# EAGLE design Conectores M2 v2 (EAGLE 9.6.2)
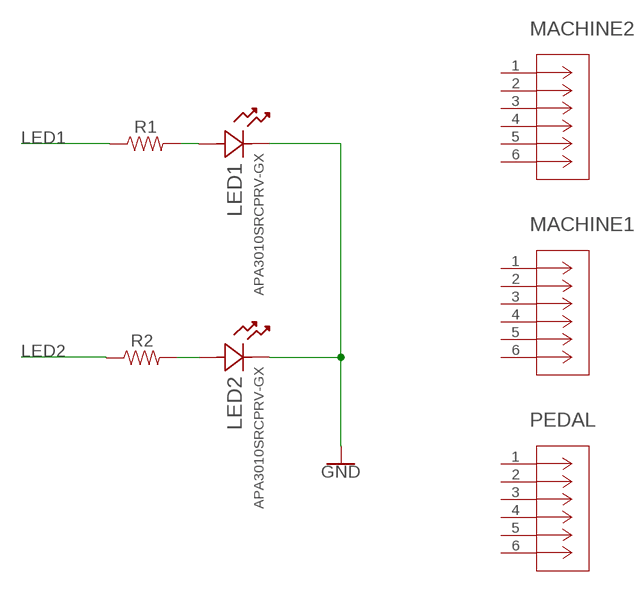
[diagram p0: schematic, sheet 1]

## Parts
LED1  APA3010SRCPRV-GX  [LED_APA3010SRCPRV-GX_KNB]
LED2  APA3010SRCPRV-GX  [LED_APA3010SRCPRV-GX_KNB]
MACHINE1  ACJS-MHDR  [CONN_MHDR_AMP]
MACHINE2  ACJS-MHDR  [CONN_MHDR_AMP]
PEDAL  ACJS-MHDR  [CONN_MHDR_AMP]
R1  RESISTOR0805  [0805]
R2  RESISTOR0805  [0805]

## Nets
GND: LED1.1 LED2.1
LED1: R1.1
LED2: R2.1
N$1: LED2.2 R2.2
N$2: LED1.2 R1.2
Unconnected: MACHINE1.1 MACHINE1.2 MACHINE1.3 MACHINE1.4 MACHINE1.5 MACHINE1.6 MACHINE2.1 MACHINE2.2 MACHINE2.3 MACHINE2.4 MACHINE2.5 MACHINE2.6 PEDAL.1 PEDAL.2 PEDAL.3 PEDAL.4 PEDAL.5 PEDAL.6

## Library data of the parts
LED1 LED2 = APA3010 Led:APA3010SRCPRV-GX; BUILT_BY: EMA_Cory; COPYRIGHT: Copyright (C) 2018 Accelerated Designs. All rights reserved; DATASHEET: https://www.kingbrightusa.com/images/catalog/SPEC/APA3010SRCPRV-GX.pdf; MANUFACTURER_PART_NUMBER: APA3010SRCPRV-GX; SOURCELIBRARY: Add_to_database_2020-11-13; VENDOR: Kingbright
MACHINE1 MACHINE2 PEDAL = ACJSMHDR:ACJS-MHDR; BUILT_BY: EMA_Matt; COPYRIGHT: Copyright (C) 2018 Accelerated Designs. All rights reserved; MANUFACTURER_PART_NUMBER: ACJS-MHDR; SOURCELIBRARY: Amphenol_2019-10-30; VENDOR: Amphenol
R1 R2 = SparkFun-Resistors:RESISTOR: Generic Resistor Package

## Board
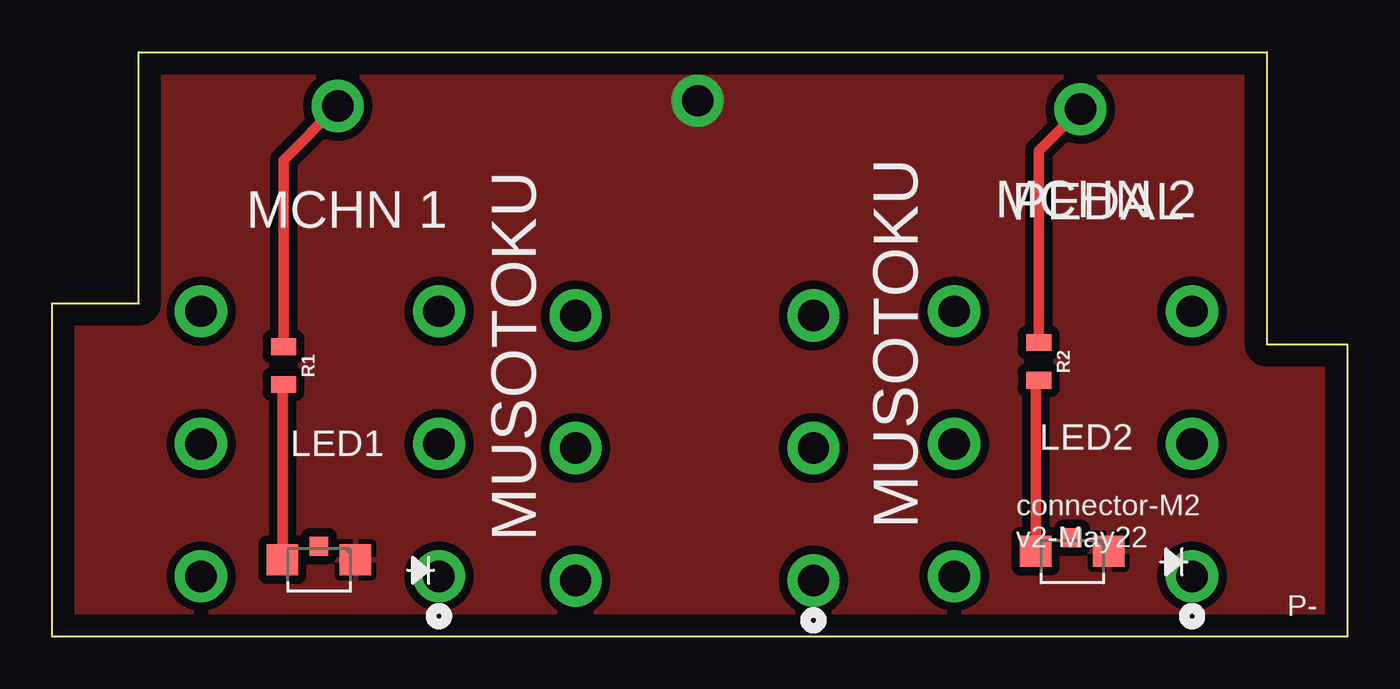
[diagram p1: board, top side]
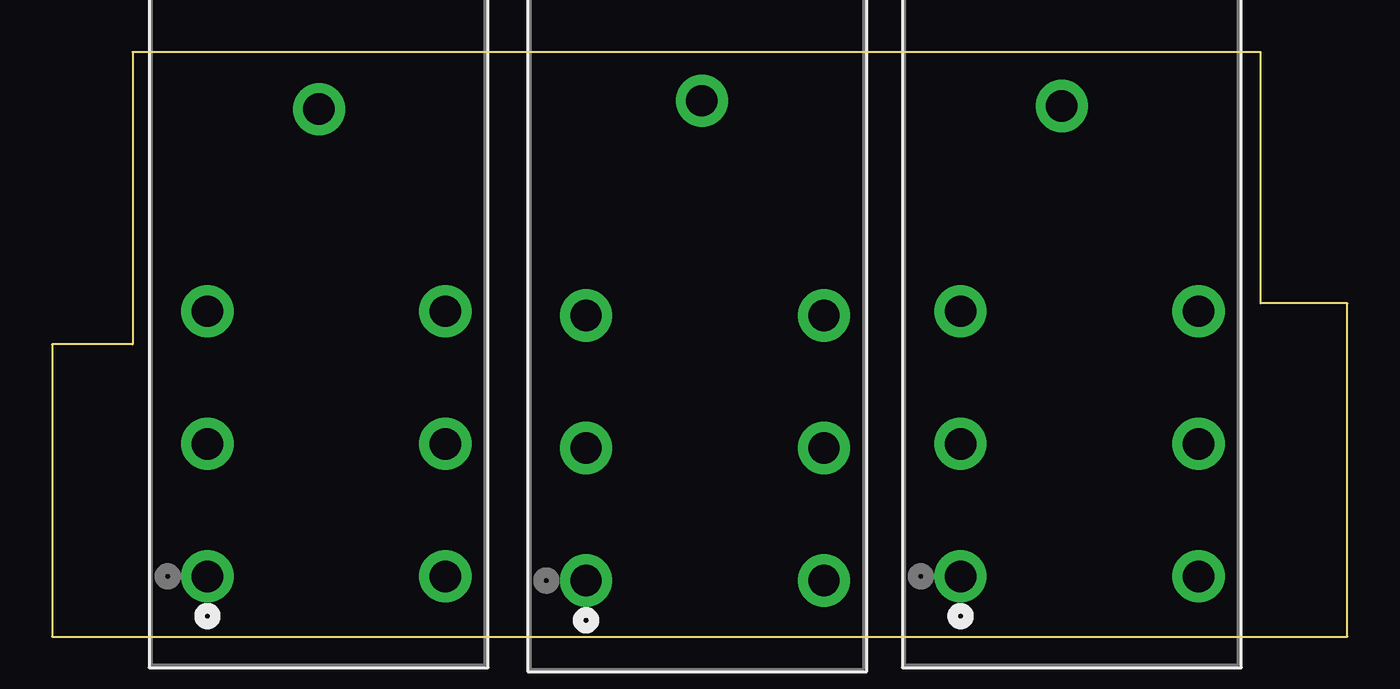
[diagram p2: board, bottom side, seen from below]

Size 62.08 x 28 mm. Coordinates in mm from the lower left corner, seen from the top.
Outline: 62.08,14 62.08,0 0,0 0,15.96 4.15,15.96 4.15,28 58.23,28 58.23,14 62.08,14
Copper layers (1*16): Top 0.035mm / dielectric 1.5mm / Bottom 0.035mm
Design rules "default": minimum track width 6mil, minimum drill 0.35mm, track to track 6mil, track to pad 6mil, pad to pad 6mil, via to via 6mil, smd to smd 6mil, copper to edge 40mil, drill to drill 6mil, minimum pad ring 10mil, minimum via ring 8mil, stop-mask expansion 4mil, vias tented up to drill 0mil, thermal gap 10mil

### Footprints (pad centres in the part's own frame; a part is rotated, then mirrored left to right if it is on the bottom)
LED_APA3010SRCPRV-GX_KNB = smd 1.499 x 1.499: 1 -0.5,1.75; 2 -0.5,-1.75 | smd 0.9 x 0.9: 3 -1.15,0
CONN_MHDR_AMP = drill 1.5 pad 2.5: 1 0,0; 2 -6.35,0; 3 -12.7,0; 4 0,11.405; 5 -6.35,11.405; 6 -12.7,11.405
0805 = smd 0.8 x 1.2: 1 -0.9,0; 2 0.9,0

### Placement (x,y rotation side)
LED1  12.79,3.18 270 top
LED2  48.89,3.58 270 top
MACHINE1  54.64,2.88 270 bottom
MACHINE2  36.49,2.68 270 bottom
PEDAL  18.54,2.88 270 bottom
R1  11.09,12.98 270 top
R2  47.29,13.18 270 top

### Tracks (layer width: path | path; a pad name or v marks a point on that pad's centre or on a via)
GND  (via drill 1.5 pad 2.5)
  other vias: 30.94,25.67
  pour Top (isolate 0.406): 0.09,32.98 63.09,32.98 63.09,-2.02 0.09,-2.02
LED1  (via drill 1.5 pad 2.5)
  Top 0.508: R1.1 11.09,22.82 v13.69,25.42
LED2  (via drill 1.5 pad 2.5)
  Top 0.508: R2.1 47.29,23.27 v49.29,25.27
N$1
  Top 0.508: LED2.2 47.14,12.13 R2.2
N$2
  Top 0.508: LED1.2 11.04,12.03 R1.2

### Text on the board
tNames: MCHN 1 | MCHN 2 | PEDAL | MUSOTOKU | MUSOTOKU | connector-M2 / v2-May22 | P-